# Altium schematic sheet mcu.SchDoc
size A4; SheetNumber: 3; SheetTotal: 3
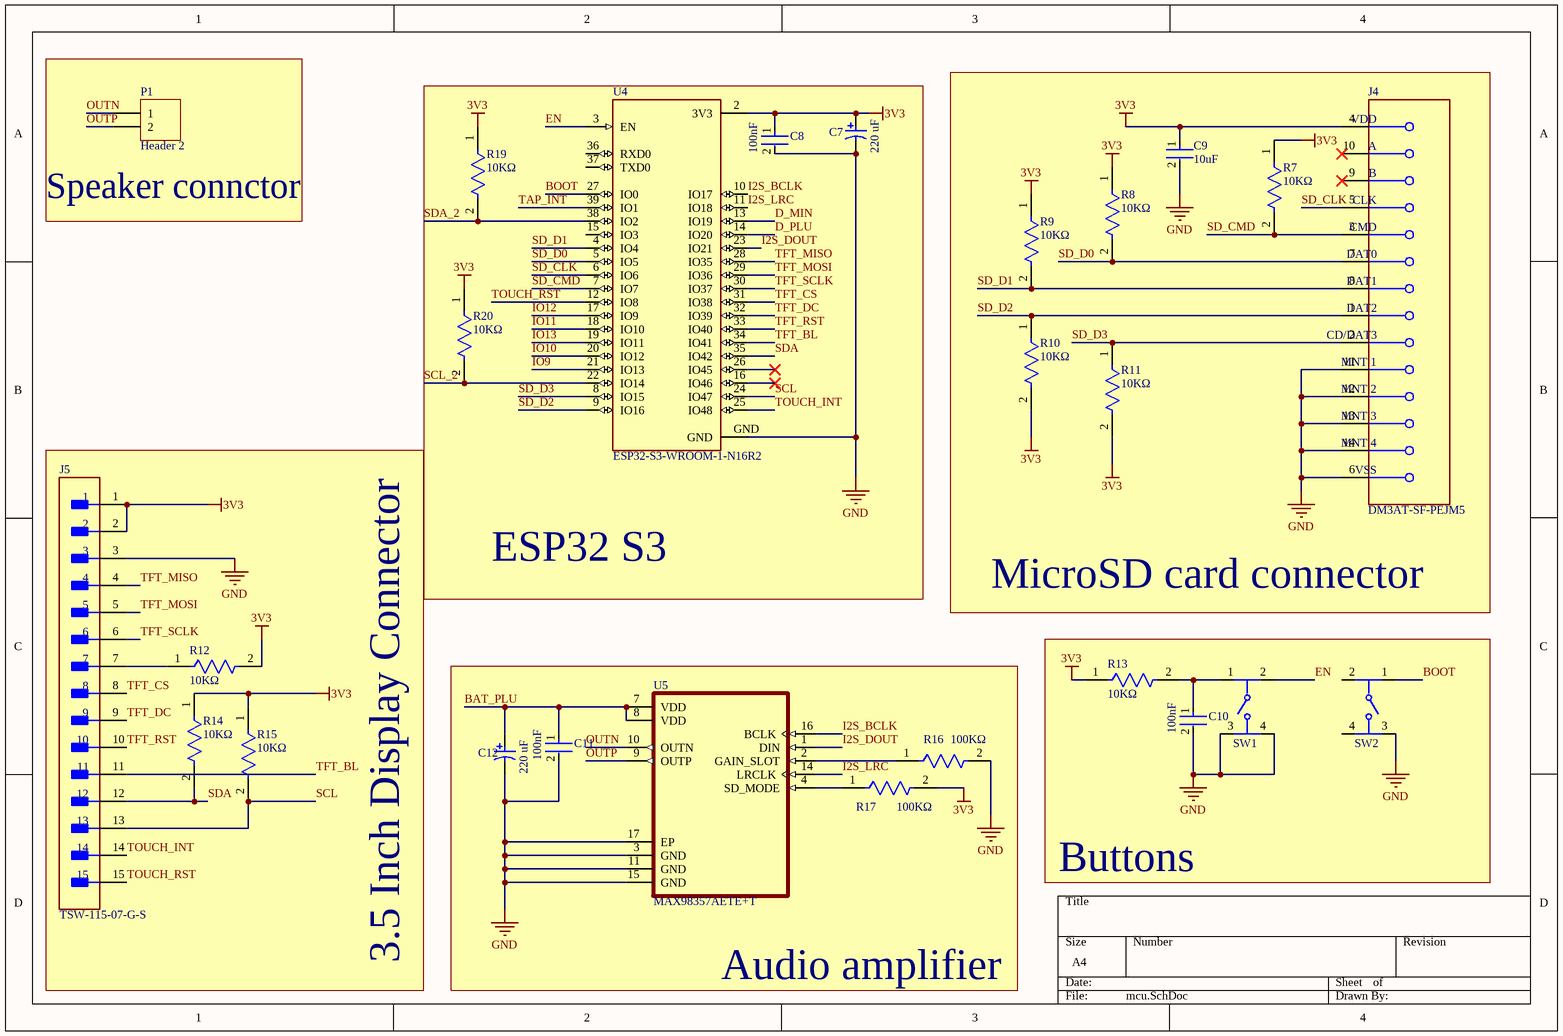
[diagram p0: mcu.SchDoc]

## Parts
C7  Rated Capacitance: 220 uF  [NIC-CAPA2-8X10_V]  (hidden comment: UUD1V221MNL1GS)
C8  Capacitance: 100nF  [FP-CC0805-EB-IPC_B]  (hidden comment: CC0805KKX7RYBB104)
C9  Capacitance: 10uF  [FP-C0805C106J8RACAUTO-IPC_B]  (hidden comment: C0805C106J8RACAUTO)
C10  Capacitance: 100nF  [FP-CC0805-EB-IPC_B]  (hidden comment: CC0805KKX7RYBB104)
C11  Capacitance: 100nF  [FP-CC0805-EB-IPC_B]  (hidden comment: CC0805KKX7RYBB104)
C12  Rated Capacitance: 220 uF  [NIC-CAPA2-8X10_V]  (hidden comment: UUD1V221MNL1GS)
J4  DM3AT-SF-PEJM5  [FP-DM3AT-SF-PEJM5-MFG]
J5  TSW-115-07-G-S  [FP-TSW-115-07-G-S-MFG]
P1  Header 2  [HDR1X2]
R7  value 10KΩ  [FP-RT0805-IPC_B]  (hidden comment: RT0805FRD0710KL)
R8  value 10KΩ  [FP-RT0805-IPC_B]  (hidden comment: RT0805FRD0710KL)
R9  value 10KΩ  [FP-RT0805-IPC_B]  (hidden comment: RT0805FRD0710KL)
R10  value 10KΩ  [FP-RT0805-IPC_B]  (hidden comment: RT0805FRD0710KL)
R11  value 10KΩ  [FP-RT0805-IPC_B]  (hidden comment: RT0805FRD0710KL)
R12  value 10KΩ  [FP-RT0805-IPC_B]  (hidden comment: RT0805FRD0710KL)
R13  value 10KΩ  [FP-RT0805-IPC_B]  (hidden comment: RT0805FRD0710KL)
R14  value 10KΩ  [FP-RT0805-IPC_B]  (hidden comment: RT0805FRD0710KL)
R15  value 10KΩ  [FP-RT0805-IPC_B]  (hidden comment: RT0805FRD0710KL)
R16  value 100KΩ  [FP-RT0805-MFG]  (hidden comment: RT0805DRD07100KL)
R17  value 100KΩ  [FP-RT0805-MFG]  (hidden comment: RT0805DRD07100KL)
R19  value 10KΩ  [FP-RT0805-IPC_B]  (hidden comment: RT0805FRD0710KL)
R20  value 10KΩ  [FP-RT0805-IPC_B]  (hidden comment: RT0805FRD0710KL)
SW1  2-1977223-2  [FP-2-1977223-2-MFG]  (value not drawn)
SW2  2-1977223-2  [FP-2-1977223-2-MFG]  (value not drawn)
U4  ESP32-S3-WROOM-1-N16R2  [XCVR_ESP32-S3-WROOM-1-N16R2]
U5  MAX98357AETE+T  [QFN50P300X300X80-17N]

## Blocks framed on the sheet
Speaker connctor: P1
ESP32 S3: C7 C8 R19 R20 U4
MicroSD card connector: C9 J4 R7-R11
3.5 Inch Display Connector: J5 R12 R14 R15
Audio amplifier: C11 C12 R16 R17 U5
Buttons: C10 R13 SW1 SW2

## Nets
3V3: C7.1 C8.1 C9.1 J4.4(VDD) J5.1 J5.2 R7.1 R8.1 R9.1 R10.2 R11.2 R12.2 R13.1 R14.1 R15.1 R17.2 R19.1 R20.1 U4.2(3V3)
GND: C7.2 C8.2 C9.2 C10.2 C11.2 C12.2 J4.6(VSS) J4.11(MNT_1) J4.12(MNT_2) J4.13(MNT_3) J4.14(MNT_4) J5.3 R16.2 SW1.3 SW1.4 SW2.3 U4.GND U5.3(GND) U5.11(GND) U5.15(GND) U5.17(EP)
BAT_PLU: C11.1 C12.1 U5.7(VDD) U5.8(VDD)
BOOT: SW2.1 U4.27(IO0)
D_MIN: U4.13(IO19)
D_PLU: U4.14(IO20)
EN: SW1.2 U4.3(EN)
I2S_BCLK: U4.10(IO17) U5.16(BCLK)
I2S_DOUT: U4.23(IO21) U5.1(DIN)
I2S_LRC: U4.11(IO18) U5.14(LRCLK)
IO9: U4.21(IO13)
IO10: U4.20(IO12)
IO11: U4.18(IO10)
IO12: U4.17(IO9)
IO13: U4.19(IO11)
OUTN: P1.1 U5.10(OUTN)
OUTP: P1.2 U5.9(OUTP)
SCL: J5.13 R15.2 U4.24(IO47)
SCL_2: R20.2 U4.22(IO14)
SD_CLK: J4.5(CLK) U4.6(IO6)
SD_CMD: J4.3(CMD) R7.2 U4.7(IO7)
SD_D0: J4.7(DAT0) R8.2 U4.5(IO5)
SD_D1: J4.8(DAT1) R9.2 U4.4(IO4)
SD_D2: J4.1(DAT2) R10.1 U4.9(IO16)
SD_D3: J4.2(CD/DAT3) R11.1 U4.8(IO15)
SDA: J5.12 R14.2 U4.35(IO42)
SDA_2: R19.2 U4.38(IO2)
TAP_INT: U4.39(IO1)
TFT_BL: J5.11 U4.34(IO41)
TFT_CS: J5.8 U4.31(IO38)
TFT_DC: J5.9 U4.32(IO39)
TFT_MISO: J5.4 U4.28(IO35)
TFT_MOSI: J5.5 U4.29(IO36)
TFT_RST: J5.10 U4.33(IO40)
TFT_SCLK: J5.6 U4.30(IO37)
TOUCH_INT: J5.14 U4.25(IO48)
TOUCH_RST: J5.15 U4.12(IO8)
NetC10_1: C10.1 R13.2 SW1.1
NetJ5_7: J5.7 R12.1
NetR16_1: R16.1 U5.2(GAIN_SLOT)
NetR17_1: R17.1 U5.4(SD_MODE)

Not connected (* = marked no-connect by the designer): J4 9(B)* 10(A)*; SW2 2 4; U4 15(IO3) 16(IO46)* 26(IO45)* 36(RXD0) 37(TXD0)

## Library data of the parts
C7 C12 = CMP-0687-00080-1: Aluminum Electrolytic Capacitor, UD Series, Low Impedance, 220 uF, 35 V, + / - 20%, -55 to 105 degC, Chip Type, 8 x 10 mm D x L, Pb-Free, Reel; Manufacturer: Nichicon; Tolerance Rated Capacitance: -20 to 20%; Rated Voltage: 35 V; Packing: Dia382mm Reel; Impedance: 0.17 Ohm; Endurance Time: 5000 h; Rated Ripple Current (at 100kHz): 450 mA; ComponentLink3URL: http://products.nichicon.co.jp/en/pdf/XJA043/e-ud.pdf; DatasheetVersion: 08/2012; PackageDescription: 2-Pin Surface Mount Device, Diameter 8 mm, Height 10 mm, Pitch 6.5 mm; Length: 10 mm; ComponentLink3Description: Package Specification; RoHS: TRUE; ComponentLink1URL: http://www.nichicon.co.jp/; PartNumber: UUD1V221MNL1GS; ComponentLink2Description: Datasheet; ComponentLink2URL: http://products.nichicon.co.jp/en/pdf/XJA043/e-ud.pdf; PackageReference: CAPAE-D8H10; Diameter: 8 mm; Mounting Technology: Surface Mount; ComponentLink1Description: Manufacturer URL; LCSC Part: C2836441
C8 C10 C11 = CMP-00621-107850848-1: CC0805KKX7RYBB104 Capacitor Ceramic 0.01uF 250V X7R 10% 0805 T/R; Material: Ceramic; Max Operating Temperature: 125°C; Tolerance: 10%; Case/Package: 0805; NexarPartId: 107850848; Height: 1.45mm; Min Operating Temperature: -55°C; Voltage Rating: 250V; LCSC Part: C28233
C9 = CMP-03020-034708-1: CAP CER 10UF 10V X7R 0805; Tolerance: 5%; Mount: Surface Mount; Voltage Rating: 10V; Max Operating Temperature: 125°C; Min Operating Temperature: -55°C; Case/Package: 0805; RoHS Compliant: Yes; Packaging: Tape and Reel; Case Code (Imperial): 0805; Case Code (Metric): 2012; Ratings: AEC-Q200; LCSC Part: C15850
J4 = CMP-2000-05150-2: CONN MICRO SD CARD PUSH-PUSH R/A; Current Rating: 500mA; Number of Contacts: 8; Pitch: 1.1mm; Gender: Female; Connector Type: Connector; Max Voltage Rating (AC): 125V; Min Operating Temperature: -25°C; Length: 15.95mm; Packaging: Tape and Reel; Width: 13.85mm; Flammability Rating: UL94 V-0; Termination: SMD/SMT; Contact Material: Copper Alloy; Depth: 15.95mm; Radiation Hardening: No; Number of Rows: 1; Max Operating Temperature: 85°C; Housing Material: Polymer; Height: 1.68mm; Package Quantity: 1; Orientation: Right Angle; REACH SVHC: No SVHC; Mount: Surface Mount; Max Current Rating: 500mA; Number of Positions: 8; Lead Free: Lead Free; Contact Plating: Gold; Voltage Rating: 125V; LCSC Part: C114218
J5 = CMP-02766-000090-1: CONN HEADER VERT 15POS 2.54MM; Manufacturer: SAMTEC; Conn Gender: Male; Number Of Contacts: 15; Conn Orientation: Vertical; Package: TSW-115-07-G-S; RoHS: TRUE; Manufacturer Part Number: TSW-115-07-G-S; Digikey Description: CONN HEADER VERT 15POS 2.54MM; Device Class L1: Connectors; Temperature Range Low: -55°C; Height: 8.71mm; Contact Material: Gold,Nickel; ComponentLink2URL: http://suddendocs.samtec.com/catalog_english/tsw_th.pdf; ComponentLink2Description: Datasheet; Category: Conn; Footprint Url: http://suddendocs.samtec.com/prints/tsw-xxx-xx-x-x-xx-xxx-footprint.pdf; Lead Free: Yes; Octopart: https://octopart.com/tsw-115-07-g-s-samtec-272210; Pitch: 2.54mm; Device Class L2: Headers and Wire Housings; Temperature: -55°C to +125°C; Number Of Rows: 1; Automotive: No; Device Class L3: unset; Temperature Range High: +125°C; LCSC Part: C2932704
P1 = Header 2: Header, 2-Pin; LatestRevisionDate: 17-Jul-2002; LatestRevisionNote: Re-released for DXP Platform.; Publisher: Altium Limited; LCSC Part: C32713268
R7-R15 R19 R20 = CMP-03412-035478-1: RES SMD 10K OHM 1% 1/8W 0805; Manufacturer: Yageo; Tolerance: 0.0001; Temperature Coefficient: 25 ppm/°C; Power Rating: 0.125W; Voltage Rating: 150V; RoHS: TRUE; Footprint Url: http://www.yageo.com/exep/pages/download/literatures/PYu-R_Mount_10.pdf; Series: RT; Octopart: https://octopart.com/rt0805frd0710kl-yageo-71399701; Digikey Description: RES SMD 10K OHM 1% 1/8W 0805; Composition: Thin Film; Manufacturer Part Number: RT0805FRD0710KL; Device Class L1: Passive Components; Automotive: No; ComponentLink2Description: Datasheet; Ipc Land Pattern Name: RESC200125X50; Device Class L2: Resistors; Resistance: 10KΩ; Temperature Range Low: -55°C; Device Class L3: Chip SMD Resistors; ComponentLink2URL: http://www.yageo.com/documents/recent/PYu-RT_1-to-0.01_RoHS_L_9.pdf; Temperature: -55°C to +155°C; Category: Res; Temperature Range High: +155°C; Lead Free: Yes; Package: RT0805; Height: 0.6mm; LCSC Part: C17414
R16 R17 = CMP-2001-01780-2: RES SMD 100K OHM 0.5% 1/8W 0805; Manufacturer: Yageo; Voltage Rating: 150V; Power Rating: 0.125W; Tolerance: 0.01; Temperature Coefficient: 25 ppm/°C; ComponentLink2Description: Datasheet; Height: 0.6mm; ComponentLink2URL: http://www.yageo.com/documents/recent/PYu-RT_1-to-0.01_RoHS_L_9.pdf; Resistance: 100KΩ; Series: RT; Digikey Description: RES SMD 100K OHM 0.5% 1/8W 0805; Temperature Range High: +155°C; Lead Free: Yes; Footprint Url: http://www.yageo.com/exep/pages/download/literatures/PYu-R_Mount_10.pdf; Octopart: https://octopart.com/rt0805drd07100kl-yageo-1251654; Manufacturer Part Number: RT0805DRD07100KL; Temperature: -55°C to +155°C; Category: Res; Automotive: No; RoHS: TRUE; Device Class L2: Resistors; Ipc Land Pattern Name: RESC200125X50; Temperature Range Low: -55°C; Device Class L1: Passive Components; Package: RT0805; Composition: Thin Film; Device Class L3: Chip SMD Resistors; LCSC Part: C25611
SW1 SW2 = CMP-03407-000026-1: SWITCH TACTILE SPST-NO 0.05A 24V; RoHS Compliant: Yes; LCSC Part: C557615
U4 = ESP32-S3-WROOM-1-N16R2: Bluetooth, WiFi 802.11b/g/n, Bluetooth v5.0 Transceiver Module 2.4GHz PCB Trace Surface Mount; MF: Espressif Systems; MP: ESP32S3WROOM1N16R2; SnapEDA_Link: https://www.snapeda.com/parts/ESP32S3WROOM1N16R2/Espressif+Systems/view-part/?ref=snap; Package: NON STANDARD Espressif Systems; Value: *; Check_prices: https://www.snapeda.com/parts/ESP32S3WROOM1N16R2/Espressif+Systems/view-part/?ref=eda; LCSC Part: C2913205
U5 = MAX98357AETE+T: Tiny, Low-Cost, PCM Class D Amplifier with Class AB Performance; MF: Analog Devices; SnapEDA_Link: https://www.snapeda.com/parts/MAX98357AETE+T/Analog+Devices/view-part/?ref=snap; Package: TQFN-16 Maxim; Value: *; MP: MAX98357AETE+T; Check_prices: https://www.snapeda.com/parts/MAX98357AETE+T/Analog+Devices/view-part/?ref=eda; LCSC Part: C910544